# Altium project dl.PrjPCB
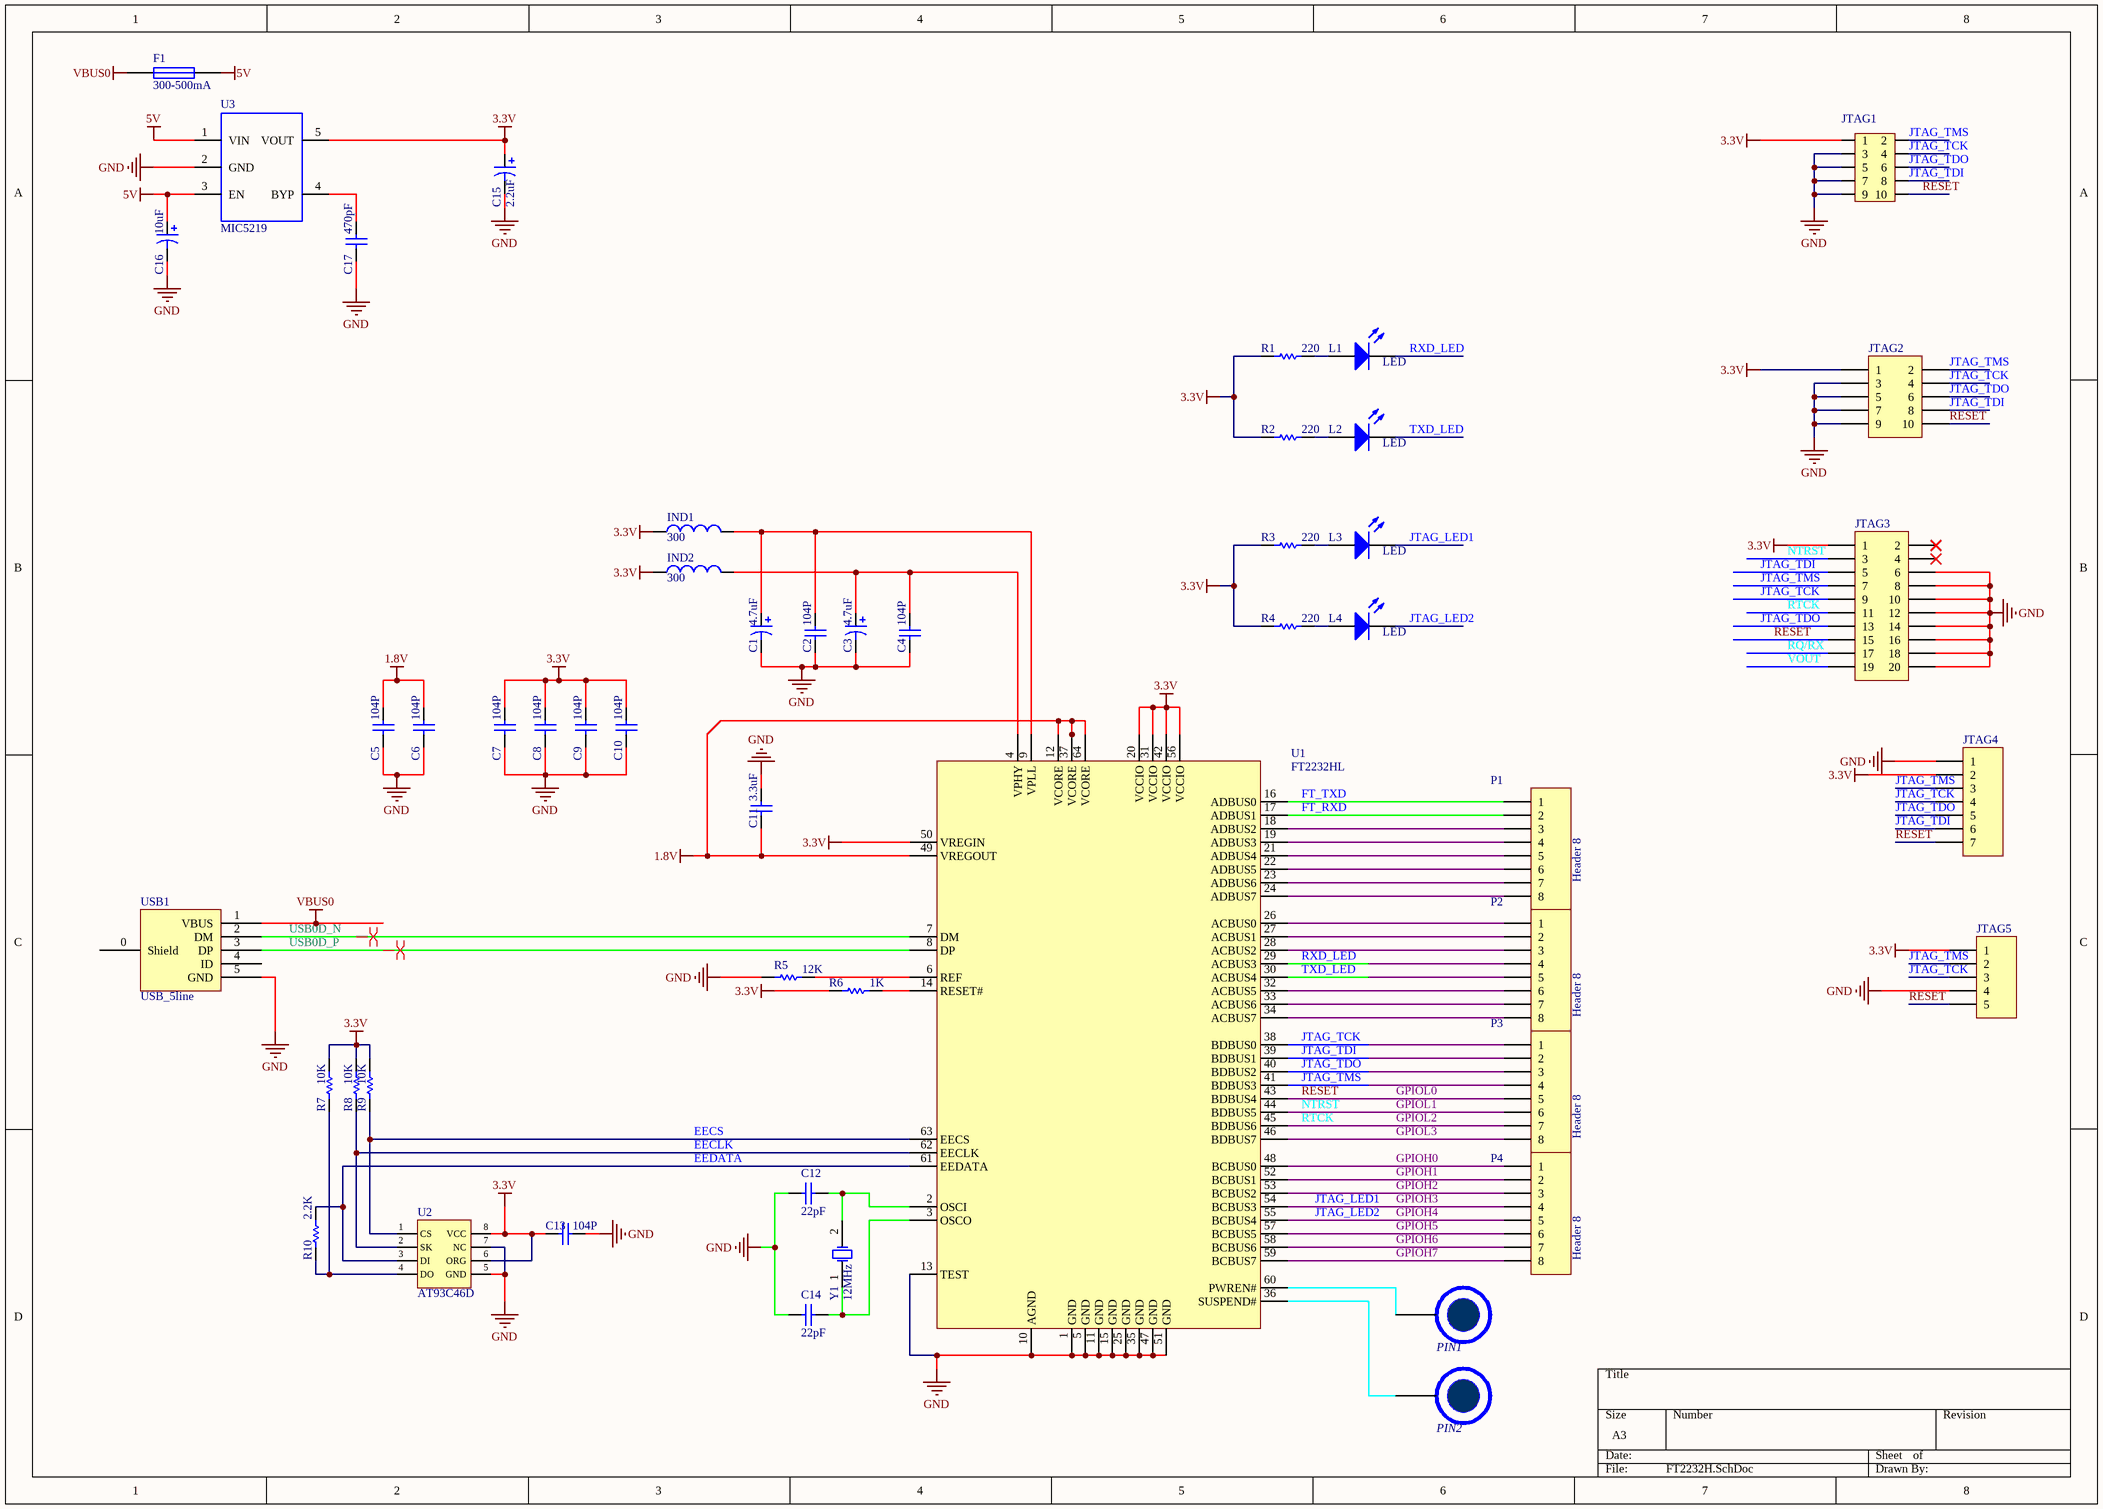
[diagram p0: FT2232H.SchDoc]
1 sheet, 50 parts. Net scope: global (net labels, ports and power ports of the same name join across sheets).
Board file: dl.PcbDoc

## Sheet FT2232H.SchDoc
size A3

### Parts
C1  value 4.7uF  [1608[0603]]  (hidden comment: Cap Pol1)
C2  value 104P  [1608[0603]]  (hidden comment: Cap)
C3  value 4.7uF  [1608[0603]]  (hidden comment: Cap Pol1)
C4  value 104P  [1608[0603]]  (hidden comment: Cap)
C5  value 104P  [1608[0603]]  (hidden comment: Cap)
C6  value 104P  [1608[0603]]  (hidden comment: Cap)
C7  value 104P  [1608[0603]]  (hidden comment: Cap)
C8  value 104P  [1608[0603]]  (hidden comment: Cap)
C9  value 104P  [1608[0603]]  (hidden comment: Cap)
C10  value 104P  [1608[0603]]  (hidden comment: Cap)
C11  value 3.3uF  [1608[0603]]  (hidden comment: Cap)
C12  value 22pF  [1608[0603]]  (hidden comment: Cap)
C13  value 104P  [1608[0603]]  (hidden comment: Cap)
C14  value 22pF  [1608[0603]]  (hidden comment: Cap)
C15  value 2.2uF  [1206(2)]  (hidden comment: Cap Pol1)
C16  value 10uF  [1206(2)]  (hidden comment: Cap Pol1)
C17  value 470pF  [1608[0603]]  (hidden comment: Cap)
F1  300-500mA  [1206(2)]
IND1  value 300  [1608[0603]]  (hidden comment: Inductor)
IND2  value 300  [1608[0603]]  (hidden comment: Inductor)
JTAG1  Header 5X2  [IDC5X2]  (value not drawn)
JTAG2  MHDR2X5  [MHDR2X5]  (value not drawn)
JTAG3  Header 10X2  [HDR2X10]  (value not drawn)
JTAG4  MHDR1X7  [MHDR1X7]  (value not drawn)
JTAG5  Header 5  [HDR1X5]  (value not drawn)
L1  LED  [1608[0603]]
L2  LED  [1608[0603]]
L3  LED  [1608[0603]]
L4  LED  [1608[0603]]
P1  Header 8  [HDR1X8]
P2  Header 8  [HDR1X8]
P3  Header 8  [HDR1X8]
P4  Header 8  [HDR1X8]
PIN1  PIN  [PIN]  (value not drawn)
PIN2  PIN  [PIN]  (value not drawn)
R1  value 220  [1608[0603]]  (hidden comment: Res)
R2  value 220  [1608[0603]]  (hidden comment: Res)
R3  value 220  [1608[0603]]  (hidden comment: Res)
R4  value 220  [1608[0603]]  (hidden comment: Res)
R5  value 12K  [1608[0603]]  (hidden comment: Res)
R6  value 1K  [1608[0603]]  (hidden comment: Res)
R7  value 10K  [1608[0603]]  (hidden comment: Res)
R8  value 10K  [1608[0603]]  (hidden comment: Res)
R9  value 10K  [1608[0603]]  (hidden comment: Res)
R10  value 2.2K  [1608[0603]]  (hidden comment: Res)
U1  FT2232HL  [LQFP-64]
U2  AT93C46D  [TSOP65P640X120-8N-AT93C46D]
U3  MIC5219  [SOT-23-5]
USB1  USB_5line  [USB-MICRO-5P-2F]
Y1  12MHz  [5032]

### Nets
1.8V: C5.2 C6.2 C11.1 U1.12(VCORE) U1.37(VCORE) U1.49(VREGOUT) U1.64(VCORE)
3.3V: C7.2 C8.2 C9.2 C10.2 C13.2 C15.1 IND1.1 IND2.1 JTAG1.1 JTAG2.1 JTAG3.1 JTAG4.2 JTAG5.1 R1.2 R2.2 R3.2 R4.2 R6.2 R7.1 R8.1 R9.1 U1.20(VCCIO) U1.31(VCCIO) U1.42(VCCIO) U1.50(VREGIN) U1.56(VCCIO) U2.6(ORG) U2.8(VCC) U3.5(VOUT)
5V: C16.1 F1.2 U3.1(VIN) U3.3(EN)
GND: C1.2 C2.1 C3.2 C4.1 C5.1 C6.1 C7.1 C8.1 C9.1 C10.1 C11.2 C12.1 C13.1 C14.2 C15.2 C16.2 C17.1 JTAG1.3 JTAG1.5 JTAG1.7 JTAG1.9 JTAG2.3 JTAG2.5 JTAG2.7 JTAG2.9 JTAG3.6 JTAG3.8 JTAG3.10 JTAG3.12 JTAG3.14 JTAG3.16 JTAG3.18 JTAG3.20 JTAG4.1 JTAG5.4 R5.2 U1.1(GND) U1.5(GND) U1.10(AGND) U1.11(GND) U1.13(TEST) U1.15(GND) U1.25(GND) U1.35(GND) U1.47(GND) U1.51(GND) U2.5(GND) U2.7(NC) U3.2(GND) USB1.5(GND)
VBUS0: F1.1 USB1.1(VBUS)
EECLK: R8.2 U1.62(EECLK) U2.2(SK)
EECS: R9.2 U1.63(EECS) U2.1(CS)
EEDATA: R10.1 U1.61(EEDATA) U2.3(DI)
FT_RXD: P1.2 U1.17(ADBUS1)
FT_TXD: P1.1 U1.16(ADBUS0)
GPIOH0: P4.1 U1.48(BCBUS0)
GPIOH1: P4.2 U1.52(BCBUS1)
GPIOH2: P4.3 U1.53(BCBUS2)
GPIOH3: L3.2(K) P4.4 U1.54(BCBUS3)  [also labelled JTAG_LED1]
GPIOH4: L4.2(K) P4.5 U1.55(BCBUS4)  [also labelled JTAG_LED2]
GPIOH5: P4.6 U1.57(BCBUS5)
GPIOH6: P4.7 U1.58(BCBUS6)
GPIOH7: P4.8 U1.59(BCBUS7)
GPIOL0: JTAG1.10 JTAG2.10 JTAG3.15 JTAG4.7 JTAG5.5 P3.5 U1.43(BDBUS4)  [also labelled RESET]
GPIOL1: JTAG3.3 P3.6 U1.44(BDBUS5)  [also labelled NTRST]
GPIOL2: JTAG3.11 P3.7 U1.45(BDBUS6)  [also labelled RTCK]
GPIOL3: P3.8 U1.46(BDBUS7)
JTAG_TCK: JTAG1.4 JTAG2.4 JTAG3.9 JTAG4.4 JTAG5.3 P3.1 U1.38(BDBUS0)
JTAG_TDI: JTAG1.8 JTAG2.8 JTAG3.5 JTAG4.6 P3.2 U1.39(BDBUS1)
JTAG_TDO: JTAG1.6 JTAG2.6 JTAG3.13 JTAG4.5 P3.3 U1.40(BDBUS2)
JTAG_TMS: JTAG1.2 JTAG2.2 JTAG3.7 JTAG4.3 JTAG5.2 P3.4 U1.41(BDBUS3)
RQ/RX: JTAG3.17
RXD_LED: L1.2(K) P2.4 U1.29(ACBUS3)
TXD_LED: L2.2(K) P2.5 U1.30(ACBUS4)
USB0D_N: U1.7(DM) USB1.2(DM)
USB0D_P: U1.8(DP) USB1.3(DP)
VOUT: JTAG3.19
NetC1_1: C1.1 C2.2 IND1.2 U1.9(VPLL)
NetC3_1: C3.1 C4.2 IND2.2 U1.4(VPHY)
NetC12_2: C12.2 U1.2(OSCI) Y1.2(OSC2)
NetC14_1: C14.1 U1.3(OSCO) Y1.1(OSC1)
NetC17_2: C17.2 U3.4(BYP)
NetL1_1: L1.1(A) R1.1
NetL2_1: L2.1(A) R2.1
NetL3_1: L3.1(A) R3.1
NetL4_1: L4.1(A) R4.1
NetP1_3: P1.3 U1.18(ADBUS2)
NetP1_4: P1.4 U1.19(ADBUS3)
NetP1_5: P1.5 U1.21(ADBUS4)
NetP1_6: P1.6 U1.22(ADBUS5)
NetP1_7: P1.7 U1.23(ADBUS6)
NetP1_8: P1.8 U1.24(ADBUS7)
NetP2_1: P2.1 U1.26(ACBUS0)
NetP2_2: P2.2 U1.27(ACBUS1)
NetP2_3: P2.3 U1.28(ACBUS2)
NetP2_6: P2.6 U1.32(ACBUS5)
NetP2_7: P2.7 U1.33(ACBUS6)
NetP2_8: P2.8 U1.34(ACBUS7)
NetPIN1_1: PIN1.1(PIN) U1.60(PWREN#)
NetPIN2_1: PIN2.1(PIN) U1.36(SUSPEND#)
NetR5_1: R5.1 U1.6(REF)
NetR6_1: R6.1 U1.14(RESET#)
NetR7_2: R7.2 R10.2 U2.4(DO)

Not connected (* = marked no-connect by the designer): JTAG3 2* 4*; USB1 0(Shield) 4(ID)

### Layout directives
differential pair: USB0D_N, USB0D_P

### Library data of the parts
C1 C3 C15 C16 = Cap Pol1: Polarized Capacitor (Radial); Published: 8-Jun-2000; LatestRevisionDate: 17-Jul-2002; LatestRevisionNote: Re-released for DXP Platform.; PackageReference: RB7.6-15; Publisher: Altium Limited; PackageDescription: Polarized Capacitor (Radial); 2 Leads
C2 C4-C14 C17 = Cap: 贴片电容; Published: 8-Jun-2000; LatestRevisionDate: 17-Jul-2002; LatestRevisionNote: Re-released for DXP Platform.; PackageReference: RAD-0.3; Publisher: Altium Limited
F1 = Fuse 1: Fuse; Published: 8-Jun-2000; LatestRevisionDate: 17-Jul-2002; LatestRevisionNote: Re-released for DXP Platform.; PackageReference: PIN-W2/E2.8; Publisher: Altium Limited
IND1 IND2 = Inductor: Code_IEC: 1005; Published: 8-Jun-2000; LatestRevisionDate: 29-May-2009; LatestRevisionNote: IPC-7351 Footprint Added.; PackageReference: 0402-A; Publisher: Altium Limited; PackageDescription: Chip Inductor; Code_JEITA: 0402
JTAG1 = Header 5X2: Header, 5-Pin, Dual row
JTAG2 = MHDR2X5: Header, 5-Pin, Dual row; LatestRevisionDate: 17-Jul-2002; LatestRevisionNote: Re-released for DXP Platform.; Publisher: Altium Limited
JTAG3 = Header 10X2: Header, 10-Pin, Dual row; LatestRevisionDate: 17-Jul-2002; LatestRevisionNote: Re-released for DXP Platform.; Publisher: Altium Limited
JTAG4 = MHDR1X7: Header, 7-Pin; LatestRevisionDate: 17-Jul-2002; LatestRevisionNote: Re-released for DXP Platform.; Publisher: Altium Limited
JTAG5 = Header 5: Header, 5-Pin; LatestRevisionDate: 17-Jul-2002; LatestRevisionNote: Re-released for DXP Platform.; Publisher: Altium Limited
P1-P4 = Header 8: Header, 8-Pin; LatestRevisionDate: 17-Jul-2002; LatestRevisionNote: Re-released for DXP Platform.; Publisher: Altium Limited
R1-R10 = Res: 贴片电阻; Published: 8-Jun-2000; LatestRevisionDate: 17-Jul-2002; LatestRevisionNote: Re-released for DXP Platform.; PackageReference: AXIAL-0.3; Publisher: Altium Limited
U3 = MIC5219: LDO
Y1 = XTAL: 晶体振荡器; Published: 8-Jun-2000; LatestRevisionDate: 17-Jul-2002; LatestRevisionNote: Re-released for DXP Platform.; PackageReference: R38; Publisher: Altium Limited